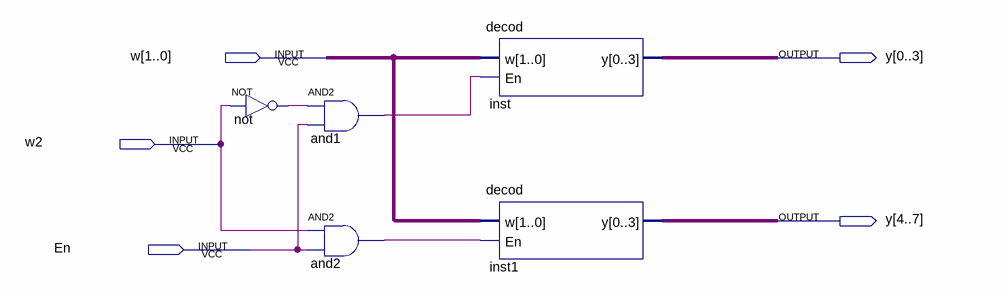
[diagram p0: schematic sheet]
// Quartus schematic decodModified.bdf as structural Verilog: 5 symbols, 5 pins
module decodModified (
  input  [1:0] w,
  input  w2,
  input  En,
  output [0:7] y
);

  wire and1_out, and2_out, not_out;

  not \not  (not_out, w2);
  and and1 (and1_out, not_out, En);
  and and2 (and2_out, w2, En);
  decod inst (.w(w), .En(and1_out), .y(y[0:3]));
  decod inst1 (.w(w), .En(and2_out), .y(y[4:7]));
endmodule
